# Altium schematic sheet DCDC_Buck_1A.SchDoc
size A4; SheetNumber: 2; SheetTotal: 5
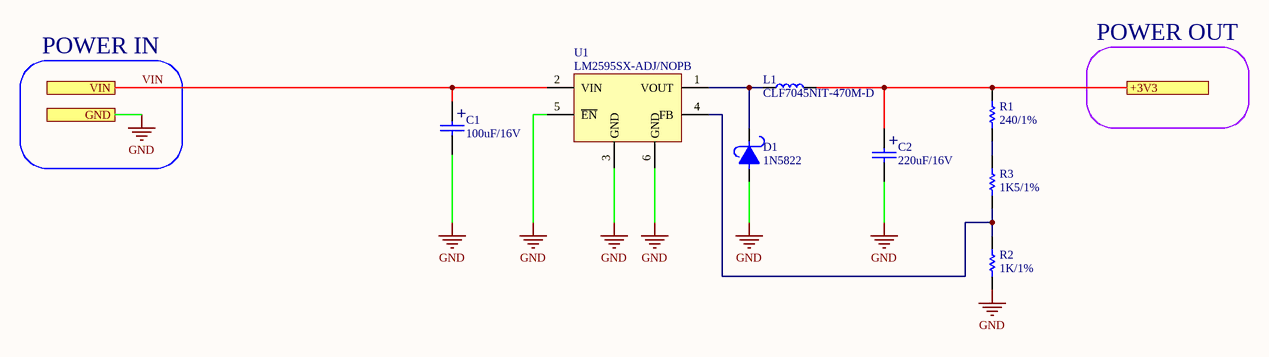
[diagram p0: DCDC_Buck_1A.SchDoc]

## Parts
C1  100uF/16V  [CAP100RP]
C2  220uF/16V  [CAP100RP]
D1  1N5822  [DO201-AD]
L1  CLF7045NIT-470M-D  [CLF7045NIT-470M-D]
R1  240/1%  [0402-RES-PANASONIC]
R2  1K/1%  [0402-RES-PANASONIC]
R3  1K5/1%  [0402-RES-PANASONIC]
U1  LM2595SX-ADJ/NOPB  [TI-TO-263-KTT]

## Ports
+3V3 (see WaterLevelControl-v1.0_top[2B], RF24_Block[1A]), GND (see WaterLevelControl-v1.0_top[2B], Input_Trafo[3B], RF24_Block[1B]), VIN (see WaterLevelControl-v1.0_top[2B])

## Nets
GND: C1.2 C2.2 D1.1 R2.1 U1.3(GND) U1.5(~{EN}) U1.6(GND) ; port GND
+3V3: C2.1 L1.2 R1.2 ; port +3V3
VIN: C1.1 U1.2(VIN) ; port VIN
NetD1_2: D1.2 L1.1 U1.1(VOUT)
NetR1_1: R1.1 R3.2
NetR2_2: R2.2 R3.1 U1.4(FB)

## Notes on the sheet
- POWER IN
- POWER OUT
- (in symbol CAPPOL-THT) +

## Library data of the parts
C1 C2 = CAPPOL-THT
D1 = DIODE SCHOTTKY: JLCPart: C84619
L1 = CLF7045NIT-470M-D: 47 µH Shielded Drum Core, Wirewound Inductor 1.26 A 160mOhm Max Nonstandard; Digikey_PN: 445-174177-1-ND
R1-R3 = RES-SMD
  R1: JLCPart: C723429
  R2: JLCPart: C11702
  R3: JLCPart: C25867
U1 = LM2595SX-ADJ/NOPB: Buck Switching Regulator IC Positive Adjustable 1.2V 1 Output 1A TO-263-6, D2PAK; JLCPart: C181391; Digikey_PN: LM2595SX-ADJ/NOPBCT-ND